# Altium schematic sheet Input.SchDoc
size A; SheetNumber: 5; SheetTotal: 6
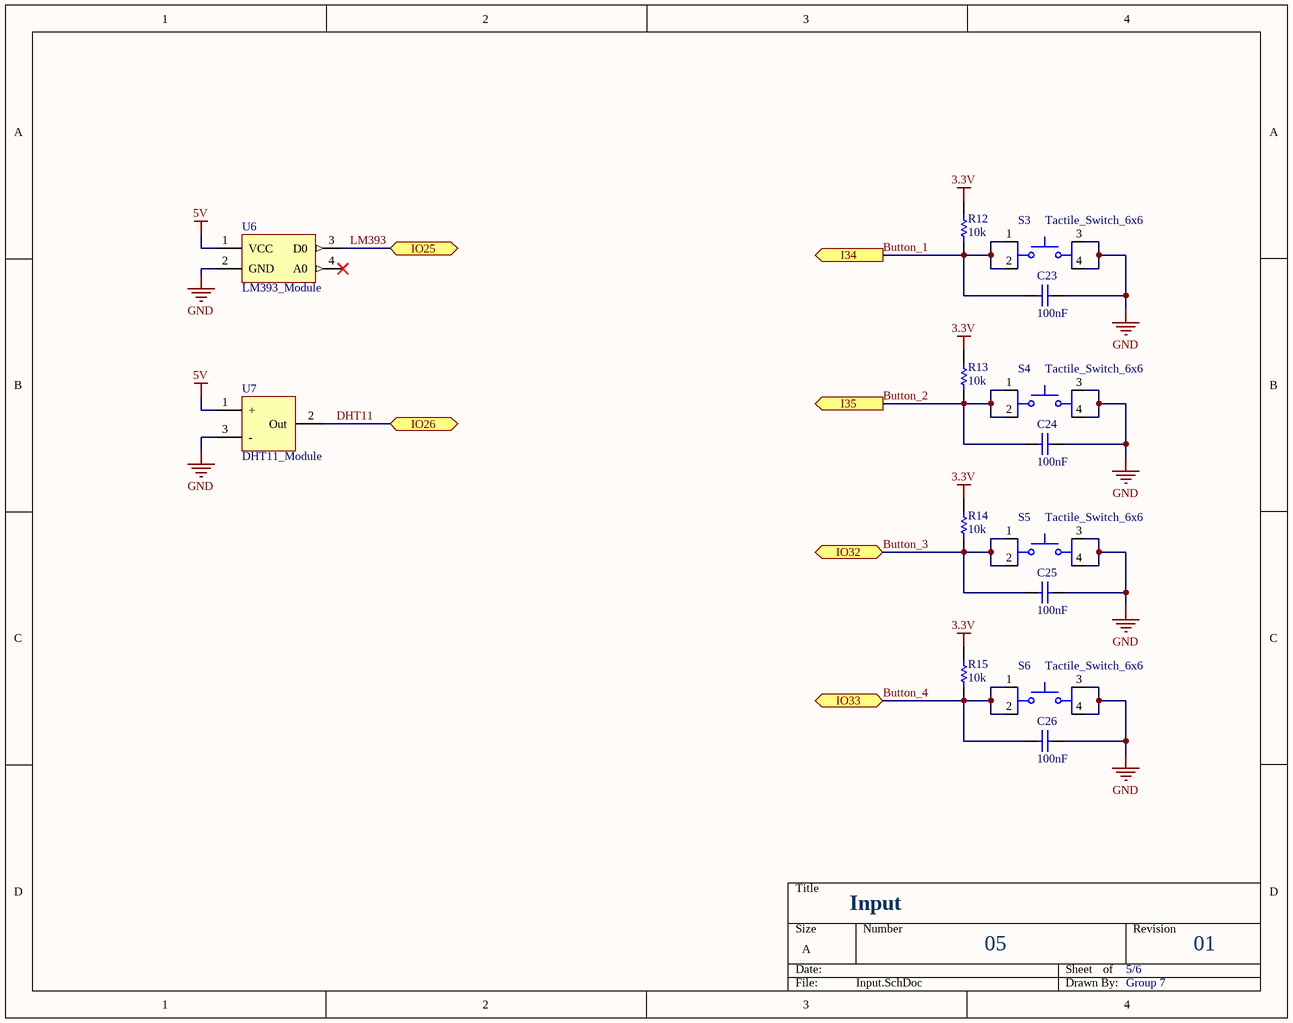
[diagram p0: Input.SchDoc]

## Parts
C23  100nF  [CAP_0603]
C24  100nF  [CAP_0603]
C25  100nF  [CAP_0603]
C26  100nF  [CAP_0603]
R12  10k  [resistor_0603]
R13  10k  [resistor_0603]
R14  10k  [resistor_0603]
R15  10k  [resistor_0603]
S3  Tactile_Switch_6x6  [Tactile_Switch_6x6]
S4  Tactile_Switch_6x6  [Tactile_Switch_6x6]
S5  Tactile_Switch_6x6  [Tactile_Switch_6x6]
S6  Tactile_Switch_6x6  [Tactile_Switch_6x6]
U6  LM393_Module  [Flame Sensor]
U7  DHT11_Module  [DHT11_Module]

## Ports
I34 (out), I35 (out), IO25 (bidir), IO26 (bidir), IO32 (bidir), IO33 (bidir)

## Nets
3.3V: R12.1 R13.1 R14.1 R15.1
5V: U6.1(VCC) U7.1(+)
GND: C23.2 C24.2 C25.2 C26.2 S3.3 S3.4 S4.3 S4.4 S5.3 S5.4 S6.3 S6.4 U6.2(GND) U7.3(-)
Button_1: C23.1 R12.2 S3.1 S3.2 ; port I34
Button_2: C24.1 R13.2 S4.1 S4.2 ; port I35
Button_3: C25.1 R14.2 S5.1 S5.2 ; port IO32
Button_4: C26.1 R15.2 S6.1 S6.2 ; port IO33
DHT11: U7.2(Out) ; port IO26
LM393: U6.3(D0) ; port IO25

Not connected (* = marked no-connect by the designer): U6 4(A0)*

## Notes on the sheet
- Input
- 05
- 5/6
- 01
- Group 7

## Library data of the parts
C23-C26 = 01060310410: CAP, size 0603, 100nF; Supply 1 SN: 885012206095; Supply 1 name: Wurth Elektronik; Supply 2 name: Thegioiic; Capacitance Tolerance: +/-10%; ComponentLink1Description: Manufacturer; ComponentLink1URL: http://www.we-online.de; ComponentLink2Description: Datasheet; ComponentLink2URL: https://www.we-online.com/catalog/datasheet/885012206095.pdf; Operating Temperature: -55 to +125degC; Packaging: Tape and Reel; Supply 1 URL: https://www.we-online.com/en/components/products/WCAP-CSGP-50VDC?sq=885012206095R#885012206095R; Supply 2 SN: *; Supply 2 URL: https://www.thegioiic.com/tu-gom-0603-100nf-0-1uf-50v; Dissipation Factor: *; Height: *; Mounting Technology: SMT; Size: 0603; Capacitance: 100nF; Technical Reference: *
R12-R15 = 0006031031: RES, 10k Ohm, size 0603, 1%; Resistance Tolerant: +/-1%; Rated Power: 1/4W; Supply 1 Name: Mouser; Supply 1 SN: 755-ESR03EZPF1002; Supply 2 Name: Digikey; Supply 2 SN: RHM10KADTR-ND RHM10KADCT-ND RHM10KADDKR-ND; Resistance: 10k; Size: 0603; Mounting Technology: SMT; ComponentLink1Description: Datasheet link; ComponentLink1URL: https://fscdn.rohm.com/en/products/databook/datasheet/passive/resistor/chip_resistor/esr-e.pdf; ComponentLink2Description: Supply 1 URL; ComponentLink2URL: https://www.mouser.vn/ProductDetail/ROHM-Semiconductor/ESR03EZPF1002?qs=sGAEpiMZZMvdGkrng054t67Efho1F8r6CDeAsqwFse8%3D; ComponentLink3Description: Supply 2 URL; ComponentLink3URL: https://www.digikey.com/en/products/detail/rohm-semiconductor/ESR03EZPF1002/1983429
S3-S6 = Tactile_Switch_6x6: Tactile Switch, 6x6mm
U6 = LM393_Module: Flame Sensor, 3.3V-5V, infrared, ouput: analog/digital.
U7 = DHT11_Module: Temperature & Humidity Sensor, 3.3V-5V, 5mA